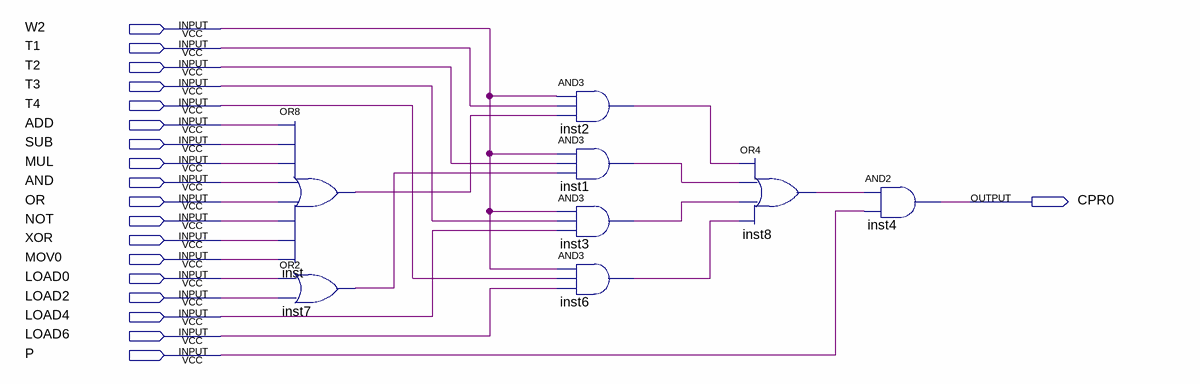
[diagram p0: schematic sheet]
// Quartus schematic CPR0.bdf as structural Verilog: 8 symbols, 19 pins
module CPR0 (
  input  W2,
  input  T1,
  input  T2,
  input  T3,
  input  T4,
  input  ADD,
  input  SUB,
  input  MUL,
  input  AND,
  input  OR,
  input  NOT,
  input  XOR,
  input  MOV0,
  input  LOAD0,
  input  LOAD2,
  input  LOAD4,
  input  LOAD6,
  input  P,
  output CPR0
);

  wire inst1_out, inst2_out, inst3_out, inst6_out, inst7_out, inst8_out, inst_out;

  or inst (inst_out, ADD, SUB, MUL, AND, OR, NOT, XOR, MOV0);
  or inst7 (inst7_out, LOAD0, LOAD2);
  and inst2 (inst2_out, W2, T1, inst_out);
  and inst1 (inst1_out, W2, T2, inst7_out);
  and inst3 (inst3_out, W2, T3, LOAD4);
  and inst6 (inst6_out, W2, T4, LOAD6);
  or inst8 (inst8_out, inst2_out, inst1_out, inst3_out, inst6_out);
  and inst4 (CPR0, inst8_out, P);
endmodule
